# Altium schematic sheet ESP32.SchDoc
size A4
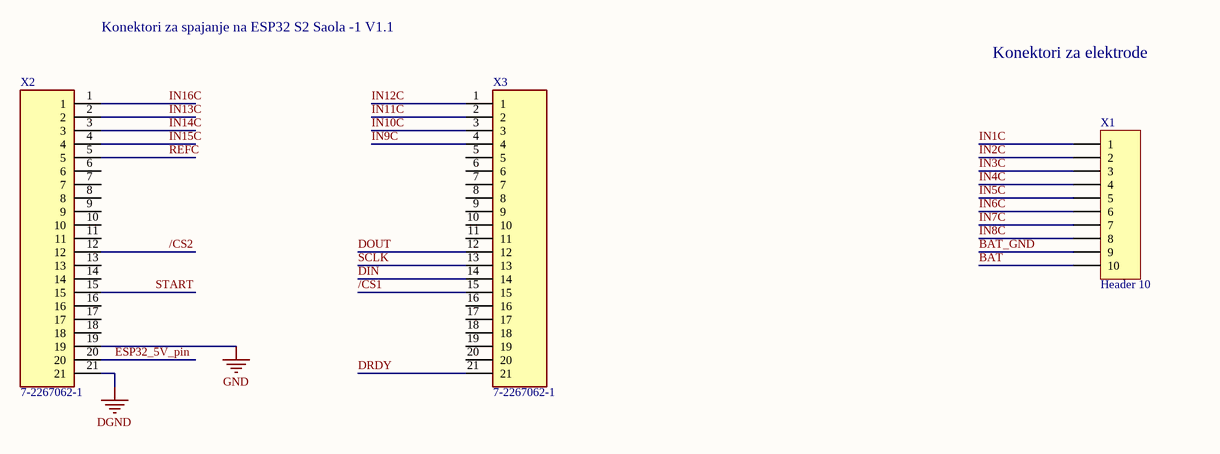
[diagram p0: ESP32.SchDoc]

## Parts
X1  Header 10  [HDR1X10]
X2  7-2267062-1  [TE_7-2267062-1]
X3  7-2267062-1  [TE_7-2267062-1]

## Nets
DGND: X2.21
GND: X2.19
/CS1: X3.15
/CS2: X2.12
BAT: X1.10
BAT_GND: X1.9
DIN: X3.14
DOUT: X3.12
DRDY: X3.21
ESP32_5V_pin: X2.20
IN1C: X1.1
IN2C: X1.2
IN3C: X1.3
IN4C: X1.4
IN5C: X1.5
IN6C: X1.6
IN7C: X1.7
IN8C: X1.8
IN9C: X3.4
IN10C: X3.3
IN11C: X3.2
IN12C: X3.1
IN13C: X2.2
IN14C: X2.3
IN15C: X2.4
IN16C: X2.1
REFC: X2.5
SCLK: X3.13
START: X2.15

Not connected (* = marked no-connect by the designer): X2 6 7 8 9 10 11 13 14 16 17 18; X3 5 6 7 8 9 10 11 16 17 18 19 20

## Notes on the sheet
- Konektori za spajanje na ESP32 S2 Saola -1 V1.1
- Konektori za elektrode

## Library data of the parts
X1 = Header 10: Header, 10-Pin; LatestRevisionDate: 17-Jul-2002; LatestRevisionNote: Re-released for DXP Platform.; Publisher: Altium Limited
X2 X3 = 7-2267062-1: Package: None; Price: None; Value: *; MP: 7-2267062-1; Availability: Unavailable